# Altium schematic sheet Modul-WRM1470-r1.0.SchDoc: Радиомодуль NB-Fi
size 420 x 297 mm; CompanyName: Телематические решения; Address1: Address1; Address2: Address2; Address3: Address3; Address4: Address4; DocumentNumber: XXXX.012345.007Э3; SheetNumber: 2; SheetTotal: 1; Scale: 1:1; Title2str: RM6-r1.0; DocumentType: Схема электрическая принципиальная; FirstReferrence: АБВГ.123456.001
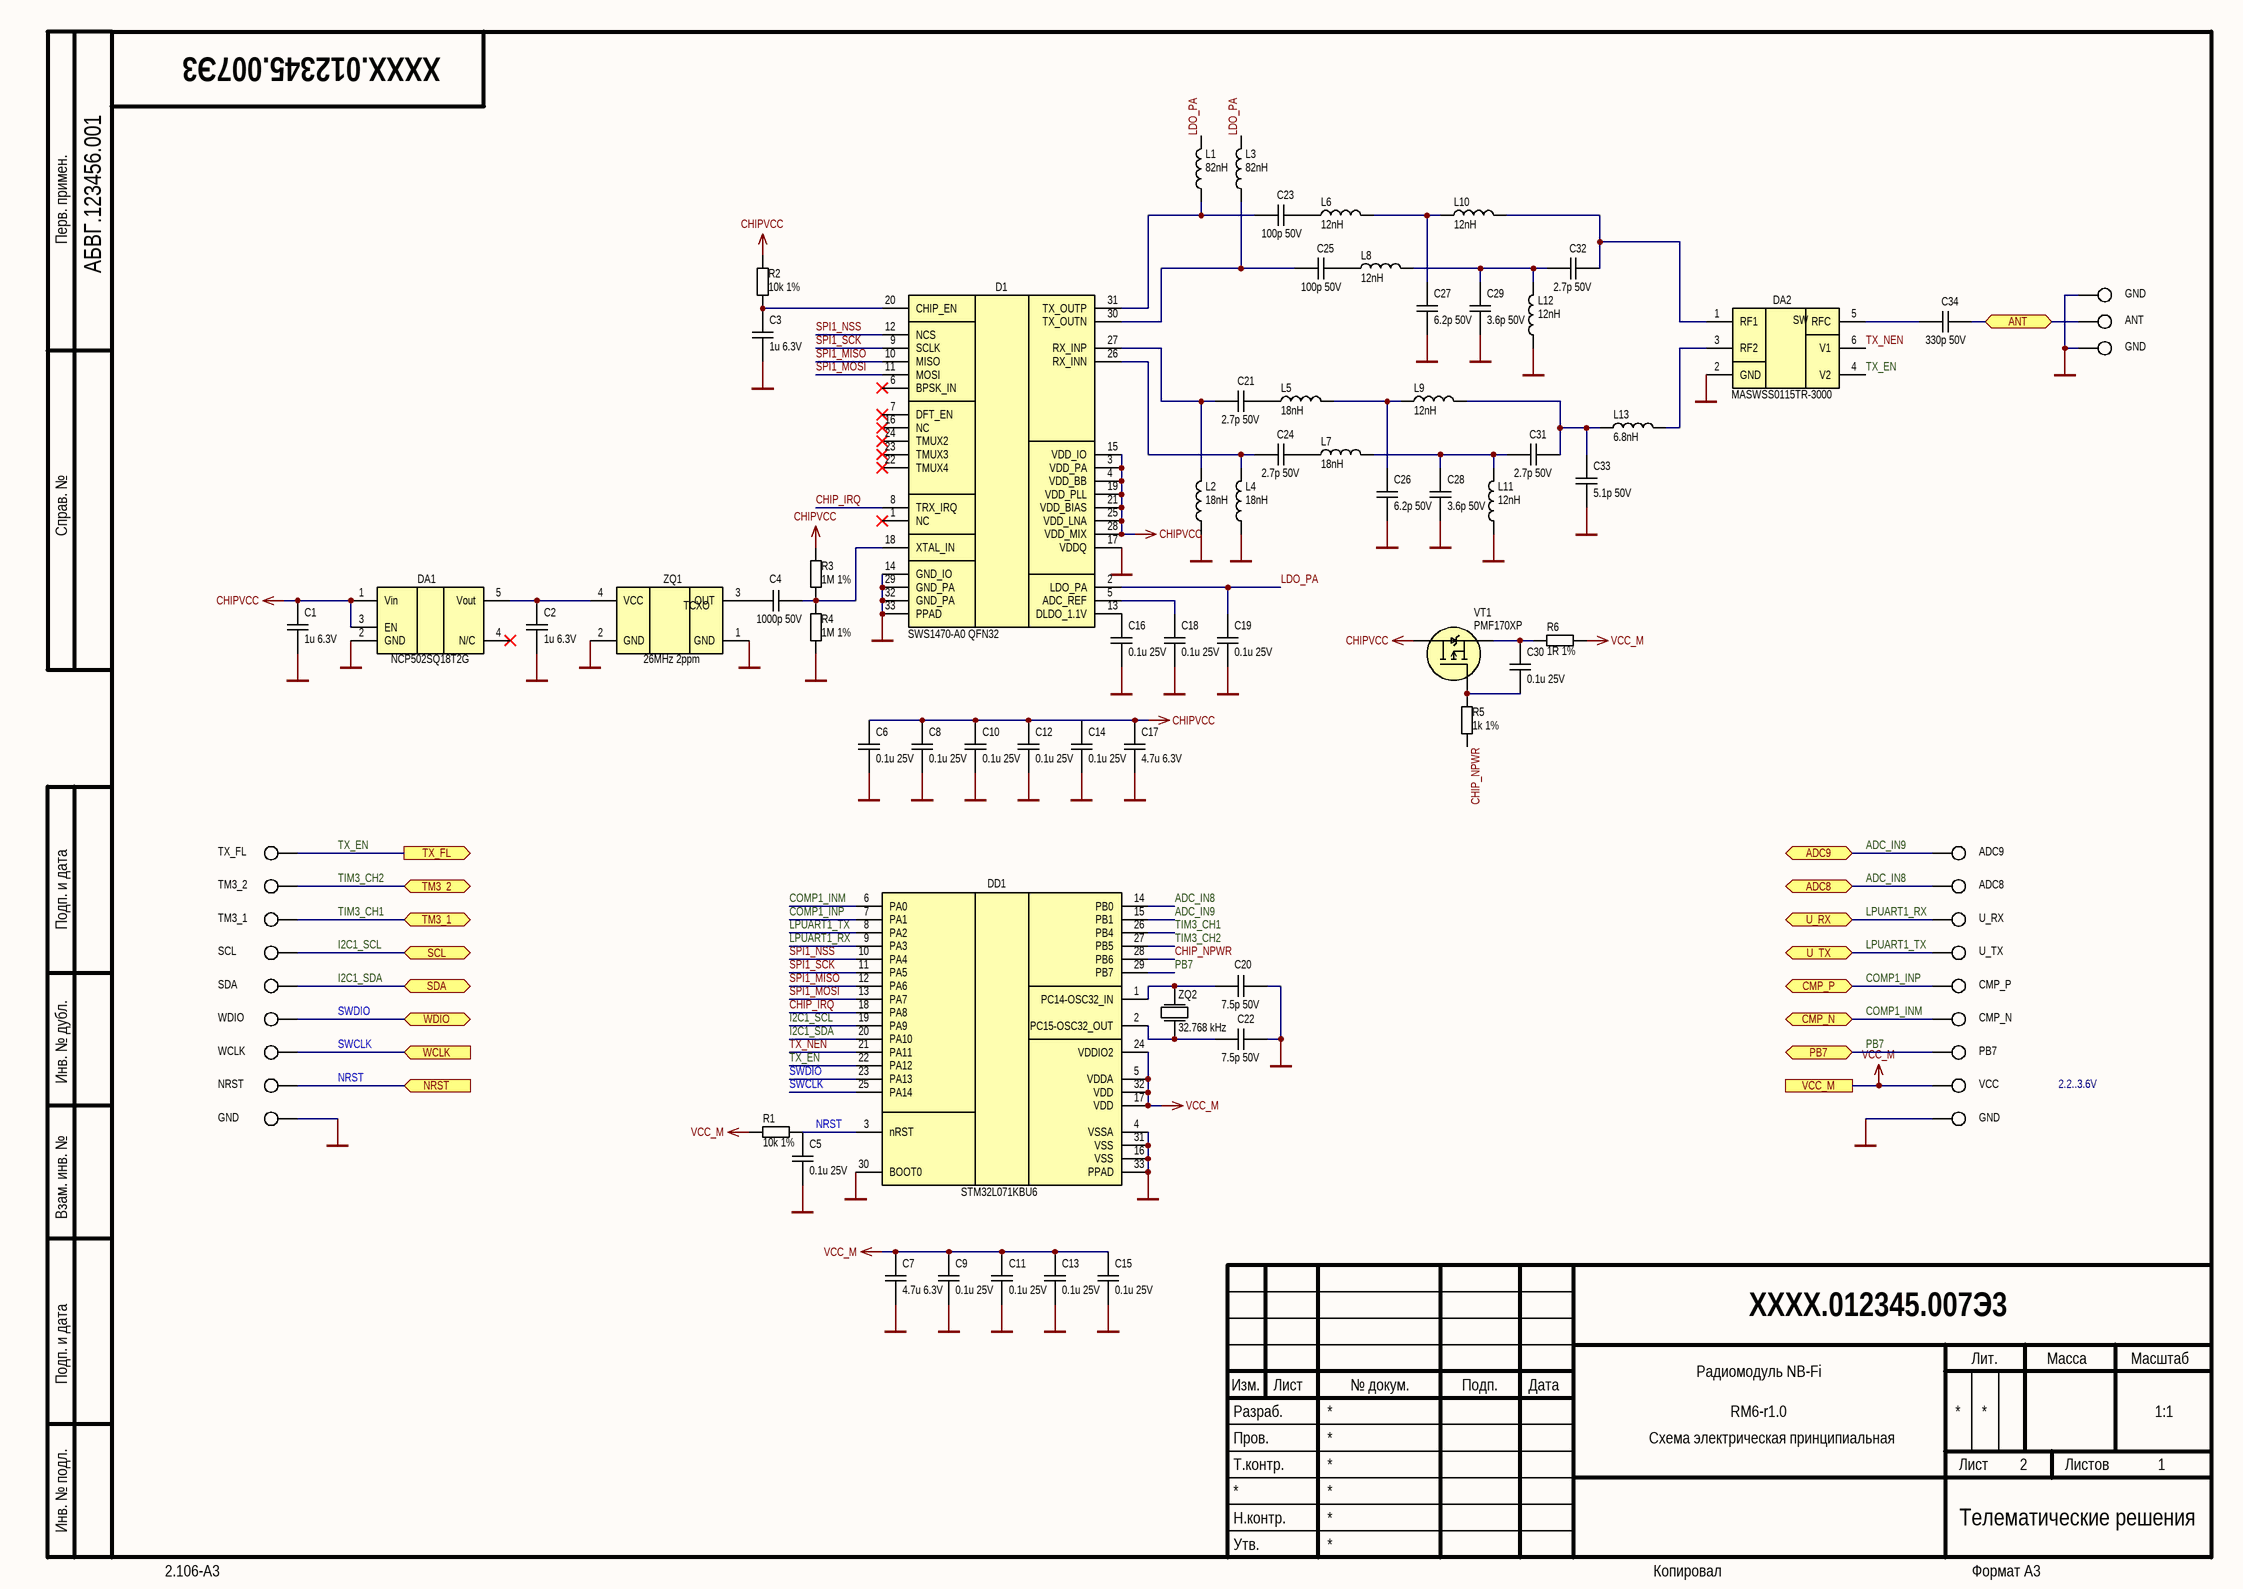
[diagram p0: Modul-WRM1470-r1.0.SchDoc]

## Parts
C1  1u 6.3V  [C0402]
C2  1u 6.3V  [C0402]
C3  1u 6.3V  [C0402]
C4  1000p 50V  [C0402]
C5  0.1u 25V  [C0402]
C6  0.1u 25V  [C0402]
C7  4.7u 6.3V  [C0402]
C8  0.1u 25V  [C0402]
C9  0.1u 25V  [C0402]
C10  0.1u 25V  [C0402]
C11  0.1u 25V  [C0402]
C12  0.1u 25V  [C0402]
C13  0.1u 25V  [C0402]
C14  0.1u 25V  [C0402]
C15  0.1u 25V  [C0402]
C16  0.1u 25V  [C0402]
C17  4.7u 6.3V  [C0402]
C18  0.1u 25V  [C0402]
C19  0.1u 25V  [C0402]
C20  7.5p 50V  [C0402]
C21  2.7p 50V  [C0402]
C22  7.5p 50V  [C0402]
C23  100p 50V  [C0402]
C24  2.7p 50V  [C0402]
C25  100p 50V  [C0402]
C26  6.2p 50V  [C0402]
C27  6.2p 50V  [C0402]
C28  3.6p 50V  [C0402]
C29  3.6p 50V  [C0402]
C30  0.1u 25V  [C0402]
C31  2.7p 50V  [C0402]
C32  2.7p 50V  [C0402]
C33  5.1p 50V  [C0402]
C34  330p 50V  [C0402]
D1  SWS1470-A0 QFN32  [QFN32]
DA1  NCP502SQ18T2G  [SOT323-5]
DA2  MASWSS0115TR-3000  [SOT323-6]
DD1  STM32L071KBU6  [UFQFPN32]
L1  82nH  [L0402_LQW]
L2  18nH  [L0402_LQW]
L3  82nH  [L0402_LQW]
L4  18nH  [L0402_LQW]
L5  18nH  [L0402_LQW]
L6  12nH  [L0402_LQW]
L7  18nH  [L0402_LQW]
L8  12nH  [L0402_LQW]
L9  12nH  [L0402_LQW]
L10  12nH  [L0402_LQW]
L11  12nH  [L0402_LQW]
L12  12nH  [L0402_LQW]
L13  6.8nH  [L0402_LQW]
R1  10k 1%  [R0402]
R2  10k 1%  [R0402]
R3  1M 1%  [R0402]
R4  1M 1%  [R0402]
R5  1k 1%  [R0402]
R6  1R 1%  [R0402]
VT1  PMF170XP  [SOT323]
X1_1  TX_FL  [PAD-d0.6-h1.1-l1.2]
X2_1  TM3_2  [PAD-d0.6-h1.1-l1.2]
X3_1  TM3_1  [PAD-d0.6-h1.1-l1.2]
X4_1  SCL  [PAD-d0.6-h1.1-l1.2]
X5_1  SDA  [PAD-d0.6-h1.1-l1.2]
X6_1  WDIO  [PAD-d0.6-h1.1-l1.2]
X7_1  WCLK  [PAD-d0.6-h1.1-l1.2]
X8_1  NRST  [PAD-d0.6-h1.1-l1.2]
X9_1  GND  [PAD-d0.6-h1.1-l1.2]
X10_1  GND  [PAD-d0.6-h1.1-l1.2]
X11_1  VCC  [PAD-d0.6-h1.1-l1.2]
X12_1  PB7  [PAD-d0.6-h1.1-l1.2]
X13_1  CMP_N  [PAD-d0.6-h1.1-l1.2]
X14_1  CMP_P  [PAD-d0.6-h1.1-l1.2]
X15_1  U_TX  [PAD-d0.6-h1.1-l1.2]
X16_1  U_RX  [PAD-d0.6-h1.1-l1.2]
X17_1  ADC8  [PAD-d0.6-h1.1-l1.2]
X18_1  ADC9  [PAD-d0.6-h1.1-l1.2]
X19_1  GND  [PAD-d0.6-h1.1-l1.2]
X20_1  ANT  [PAD-d0.6-h1.1-l1.2]
X21_1  GND  [PAD-d0.6-h1.1-l1.2]
ZQ1  26MHz 2ppm  [QSMD2.0x1.6x0.7]
ZQ2  32.768 kHz  [QSMD3.2X1.5X0.8]

## Ports
ADC8 (bidir), ADC9 (bidir), ANT (bidir), CMP_N (bidir), CMP_P (bidir), NRST (in), PB7 (bidir), SCL (bidir), SDA (bidir), TM3_1 (bidir), TM3_2 (bidir), TX_FL (out), U_RX (bidir), U_TX (bidir), VCC_M, WCLK (in), WDIO (bidir)

## Nets
CHIPVCC: C1.2 C6.2 C8.2 C10.2 C12.2 C14.2 C17.2 D1.3(VDD_PA) D1.4(VDD_BB) D1.15(VDD_IO) D1.19(VDD_PLL) D1.21(VDD_BIAS) D1.25(VDD_LNA) D1.28(VDD_MIX) DA1.1(Vin) DA1.3(EN) R2.2 R3.2 VT1.3(D)
GND: C1.1 C2.1 C3.1 C5.2 C6.1 C7.2 C8.1 C9.2 C10.1 C11.2 C12.1 C13.2 C14.1 C15.2 C16.1 C17.1 C18.1 C19.1 C20.2 C22.2 C26.2 C27.2 C28.2 C29.2 C33.1 D1.14(GND_IO) D1.17(VDDQ) D1.29(GND_PA) D1.32(GND_PA) D1.33(PPAD) DA1.2(GND) DA2.2(GND) DD1.4(VSSA) DD1.16(VSS) DD1.30(BOOT0) DD1.31(VSS) DD1.33(PPAD) L2.2 L4.2 L11.1 L12.1 R4.1 X9_1.1 X10_1.1 X19_1.1 X21_1.1 ZQ1.1(GND) ZQ1.2(GND)
VCC_M: C7.1 C9.1 C11.1 C13.1 C15.1 DD1.5(VDDA) DD1.17(VDD) DD1.24(VDDIO2) DD1.32(VDD) R1.1 R6.1 X11_1.1 ; port VCC_M
ADC_IN8: DD1.14(PB0) X17_1.1 ; port ADC8
ADC_IN9: DD1.15(PB1) X18_1.1 ; port ADC9
ANT: C34.1 X20_1.1 ; port ANT
CHIP_IRQ: D1.8(TRX_IRQ) DD1.18(PA8)
CHIP_NPWR: DD1.28(PB6) R5.1
COMP1_INM: DD1.6(PA0) X13_1.1 ; port CMP_N
COMP1_INP: DD1.7(PA1) X14_1.1 ; port CMP_P
I2C1_SCL: DD1.19(PA9) X4_1.1 ; port SCL
I2C1_SDA: DD1.20(PA10) X5_1.1 ; port SDA
LDO_PA: C19.2 D1.2(LDO_PA) L1.2 L3.2
LPUART1_RX: DD1.9(PA3) X16_1.1 ; port U_RX
LPUART1_TX: DD1.8(PA2) X15_1.1 ; port U_TX
NRST: C5.1 DD1.3(nRST) R1.2 X8_1.1 ; port NRST
PB7: DD1.29(PB7) X12_1.1 ; port PB7
SPI1_MISO: D1.10(MISO) DD1.12(PA6)
SPI1_MOSI: D1.11(MOSI) DD1.13(PA7)
SPI1_NSS: D1.12(NCS) DD1.10(PA4)
SPI1_SCK: D1.9(SCLK) DD1.11(PA5)
SWCLK: DD1.25(PA14) X7_1.1 ; port WCLK
SWDIO: DD1.23(PA13) X6_1.1 ; port WDIO
TIM3_CH1: DD1.26(PB4) X3_1.1 ; port TM3_1
TIM3_CH2: DD1.27(PB5) X2_1.1 ; port TM3_2
TX_EN: DA2.4(V2) DD1.22(PA12) X1_1.1 ; port TX_FL
TX_NEN: DA2.6(V1) DD1.21(PA11)
NetC2_2: C2.2 DA1.5(Vout) ZQ1.4(VCC)
NetC3_2: C3.2 D1.20(CHIP_EN) R2.1
NetC4_1: C4.1 ZQ1.3(OUT)
NetC4_2: C4.2 D1.18(XTAL_IN) R3.1 R4.2
NetC16_2: C16.2 D1.13(DLDO_1.1V)
NetC18_2: C18.2 D1.5(ADC_REF)
NetC20_1: C20.1 DD1.1(PC14-OSC32_IN) ZQ2.1
NetC21_1: C21.1 D1.27(RX_INP) L2.1
NetC21_2: C21.2 L5.1
NetC22_1: C22.1 DD1.2(PC15-OSC32_OUT) ZQ2.3
NetC23_1: C23.1 D1.31(TX_OUTP) L1.1
NetC23_2: C23.2 L6.1
NetC24_1: C24.1 D1.26(RX_INN) L4.1
NetC24_2: C24.2 L7.1
NetC25_1: C25.1 D1.30(TX_OUTN) L3.1
NetC25_2: C25.2 L8.1
NetC26_1: C26.1 L5.2 L9.1
NetC27_1: C27.1 L6.2 L10.1
NetC28_1: C28.1 C31.1 L7.2 L11.2
NetC29_1: C29.1 C32.1 L8.2 L12.2
NetC30_1: C30.1 R5.2 VT1.1(G)
NetC30_2: C30.2 R6.2 VT1.2(S)
NetC31_2: C31.2 C33.2 L9.2 L13.1
NetC32_2: C32.2 DA2.1(RF1) L10.2
NetC34_2: C34.2 DA2.5(RFC)
NetDA2_3: DA2.3(RF2) L13.2

Not connected (* = marked no-connect by the designer): D1 1(NC)* 6(BPSK_IN)* 7(DFT_EN)* 16(NC)* 22(TMUX4)* 23(TMUX3)* 24(TMUX2)*; DA1 4(N/C)*

## Notes on the sheet
- 2.2..3.6V
- Перв. примен.
- Справ. №
- Подп. и дата
- Инв. № дубл.
- Взам. инв. №
- Разраб.
- Изм.
- Лист
- № докум.
- Подп.
- Дата
- Лит.
- Масса
- Масштаб
- Пров.
- Т.контр.
- Листов
- Инв. № подл.
- Утв.
- Н.контр.
- 2.106-A3
- Копировал
- Формат А3
- (in symbol MASWSS0115x) SW
- (in symbol NT2016SA-26.000000MHZ-NBG2) TCXO

## Library data of the parts
C1-C3 = CC0402KRX5R5BB105: CAP CER 1UF 6.3V X5R 0402; PartNumber: CC0402KRX5R5BB105
C4 = CC0402JRX7R9BB102: CAP CER 1000PF 50V X7R 0402; PartNumber: CC0402JRX7R9BB102
C5 C6 C8-C16 C18 C19 C30 = CC0402KRX7R8BB104: CAP CER 0.1UF 25V X7R 0402; PartNumber: CC0402KRX7R8BB104
C7 C17 = CC0402KRX5R5BB475: CAP CER 4.7UF 6.3V X5R 0402; PartNumber: CC0402KRX5R5BB475
C20 C22 = CC0402CRNPO9BN7R5: CAP CER 7.5PF 50V C0G/NPO 0402; PartNumber: CC0402CRNPO9BN7R5
C21 C24 C31 C32 = CC0402BRNPO9BN2R7: CAP CER 2.7PF 50V C0G/NPO 0402; PartNumber: CC0402BRNPO9BN2R7
C23 C25 = CC0402JRNPO9BN101: CAP CER 100PF 50V C0G/NPO 0402; PartNumber: CC0402JRNPO9BN101
C26 C27 = CC0402CRNPO9BN6R2: CAP CER 6.2PF 50V NPO 0402; PartNumber: CC0402CRNPO9BN6R2
C28 C29 = CC0402BRNPO9BN3R6: CAP CER 3.6PF 50V NPO 0402; PartNumber: CC0402BRNPO9BN3R6
C33 = CC0402CRNPO9BN5R1: CAP CER 5.1PF 50V C0G/NPO 0402; PartNumber: CC0402CRNPO9BN5R1
C34 = CC0402JRNPO9BN331: CAP CER 330PF 50V C0G/NPO 0402; PartNumber: CC0402JRNPO9BN331
D1 = SWS1470-A0 QFN32: Waviot NB-Fi RF Transceiver QFN32; PartNumber: SWS1470-A0 QFN32
DA1 = NCP502SQ18T2G: IC REG LINEAR 1.8V 80MA SC88A; PartNumber: NCP502SQ18T2G
DA2 = MASWSS0115x: RF Switch ICs DC-3.0GHz ISO 22dB IL <.3dB @ 2.4GHz; PartNumber: MASWSS0115TR-3000
DD1 = STM32L071KBU6: ARM® Cortex®-M0+ STM32L0 Microcontroller IC 32-Bit 32MHz 128KB (128K x 8) FLASH 32-UFQFPN (5x5); PartNumber: STM32L071KBU6
L1 L3 = LQW15AN82NG00D: FIXED IND 82NH 130MA 2.24 OHM; PartNumber: LQW15AN82NG00D
L2 L4 L5 L7 = LQW15AN18NG00D: FIXED IND 18NH 370MA 270 MOHM; PartNumber: LQW15AN18NG00D
L6 L8-L12 = LQW15AN12NG00D: FIXED IND 12NH 500MA 140 MOHM; PartNumber: LQW15AN12NG00D
L13 = LQW15AN6N8G00D: FIXED IND 6.8NH 700MA 90 MOHM; PartNumber: LQW15AN6N8G00D
R1 R2 = RC0402FR-0710KL: RES SMD 10K OHM 1% 1/16W 0402; PartNumber: RC0402FR-0710KL
R3 R4 = RC0402FR-071ML: RES SMD 1M OHM 1% 1/16W 0402; PartNumber: RC0402FR-071ML
R5 = RC0402FR-071KL: RES SMD 1K OHM 1% 1/16W 0402; PartNumber: RC0402FR-071KL
R6 = RC0402FR-071RL: RES SMD 1 OHM 1% 1/16W 0402; PartNumber: RC0402FR-071RL
VT1 = PMF170XP: MOSFET P-CH 20V 1A SOT323; PartNumber: PMF170XP
X1_1 X2_1 X3_1 X4_1 X5_1 X6_1 X7_1 X8_1 X9_1 X10_1 X11_1 X12_1 X13_1 X14_1 X15_1 X16_1 X17_1 X18_1 X19_1 X20_1 X21_1 = PIN
ZQ1 = NT2016SA-26.000000MHZ-NBG2: TCXO Oscillator 4-pin; PartNumber: NT2016SA-26.000000MHZ-NBG2
ZQ2 = KX-327NHT 32.768 kHz: Crystals 32.768KHz 12.5pF -40C +85C; PartNumber: KX-327NHT 32.768 kHz